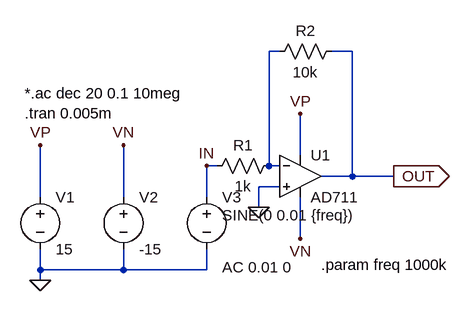
[diagram p0: schematic A2 12.asc]
A2 12.asc, the LTspice schematic file:
Version 4
SHEET 1 880 680
WIRE 128 -16 112 -16
WIRE 240 -16 208 -16
WIRE 160 144 160 80
WIRE 32 160 16 160
WIRE 112 160 112 -16
WIRE 128 160 112 160
WIRE 240 176 240 -16
WIRE 240 176 192 176
WIRE 304 176 240 176
WIRE 128 192 96 192
WIRE -240 208 -240 128
WIRE -112 208 -112 128
WIRE 16 208 16 160
WIRE 96 224 96 192
WIRE 160 272 160 208
WIRE -240 320 -240 288
WIRE -112 320 -112 288
WIRE -112 320 -240 320
WIRE 16 320 16 288
WIRE 16 320 -112 320
WIRE -240 336 -240 320
FLAG 160 80 VP
FLAG 160 272 VN
FLAG 96 224 0
FLAG -240 336 0
FLAG -240 128 VP
FLAG -112 128 VN
FLAG 16 160 IN
FLAG 304 176 OUT
IOPIN 304 176 Out
SYMBOL OpAmps\\AD711 160 112 R0
SYMATTR InstName U1
SYMBOL voltage -240 192 R0
SYMATTR InstName V1
SYMATTR Value 15
SYMBOL voltage -112 192 R0
SYMATTR InstName V2
SYMATTR Value -15
SYMBOL voltage 16 192 R0
WINDOW 123 24 124 Left 2
WINDOW 39 0 0 Left 0
WINDOW 3 24 44 Left 2
SYMATTR Value2 AC 0.01 0
SYMATTR Value SINE(0 0.01 {freq})
SYMATTR InstName V3
SYMBOL res 128 144 R90
WINDOW 0 0 56 VBottom 2
WINDOW 3 32 56 VTop 2
SYMATTR InstName R1
SYMATTR Value 1k
SYMBOL res 224 -32 R90
WINDOW 0 0 56 VBottom 2
WINDOW 3 32 56 VTop 2
SYMATTR InstName R2
SYMATTR Value 10k
TEXT -264 48 Left 2 !*.ac dec 20 0.1 10meg \n.tran 0.005m
TEXT 192 312 Left 2 !.param freq 1000k

The netlist it stands for:
* A2 12.asc
XU1 0 N001 VP VN OUT AD712  ; AD711, pins In+ In- V+ V- OUT
V1 VP 0 15
V2 VN 0 -15
V3 IN 0 SINE(0 0.01 {freq}) AC 0.01 0
R1 N001 IN 1k
R2 OUT N001 10k
*.ac dec 20 0.1 10meg
.tran 0.005m
.param freq 1000k
.lib ADI1.lib
.backanno
.end

* Results of the author's LTspice run, read from the files saved beside the schematic
* Operating Point, zero values left out:
*   V(vp) = 15 V
*   V(out) = 250 nV
*   V(vn) = -15 V
*   I(R2) = 25 pA
*   I(V2) = 4.899 mA
*   I(V1) = -4.899 mA
*   Ix(u1:1) = 25 pA
*   Ix(u1:2) = 25 pA
*   Ix(u1:3) = 4.899 mA
*   Ix(u1:4) = -4.899 mA
*   Ix(u1:5) = -25 pA
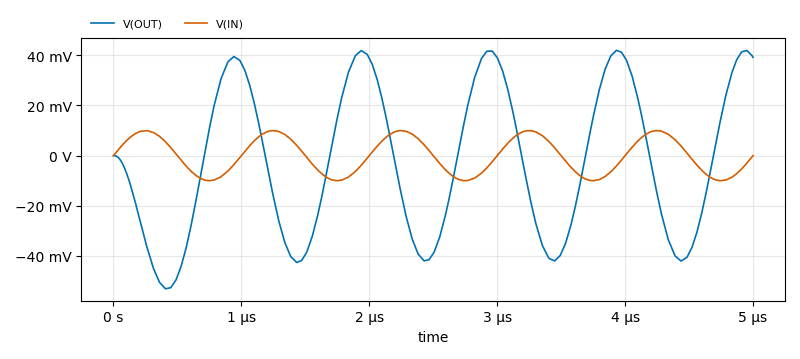
[diagram p1: Transient Analysis of A2 12.asc, plotted from the saved traces]
* Transient Analysis, 1 run:
*   V(OUT): min -53.09 mV, max 41.98 mV, average -2.693 mV, rms 30.46 mV, last 39.17 mV
*   V(IN): min -10 mV, max 9.998 mV, average -395.8 nV, rms 7.071 mV, last 0 V